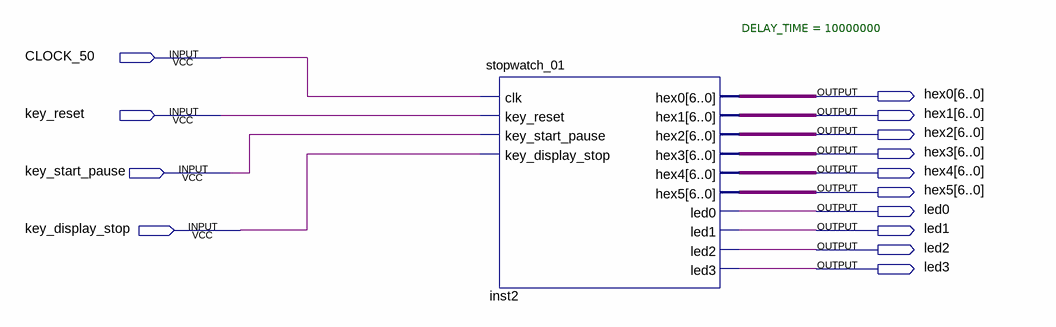
[diagram p0: schematic sheet]
// Quartus schematic first_stopwatch.bdf as structural Verilog: 1 symbols, 14 pins
module first_stopwatch (
  input  CLOCK_50,
  input  key_reset,
  input  key_start_pause,
  input  key_display_stop,
  output [6:0] hex0,
  output [6:0] hex1,
  output [6:0] hex2,
  output [6:0] hex3,
  output [6:0] hex4,
  output [6:0] hex5,
  output led0,
  output led1,
  output led2,
  output led3
);

  stopwatch_01 #(.DELAY_TIME(10000000)) inst2 (
    .clk(CLOCK_50), .key_reset(key_reset), .key_start_pause(key_start_pause),
    .key_display_stop(key_display_stop), .hex0(hex0), .hex1(hex1), .hex2(hex2), .hex3(hex3), .hex4(hex4),
    .hex5(hex5), .led0(led0), .led1(led1), .led2(led2), .led3(led3));
endmodule
